# Altium project Power.PrjPcb
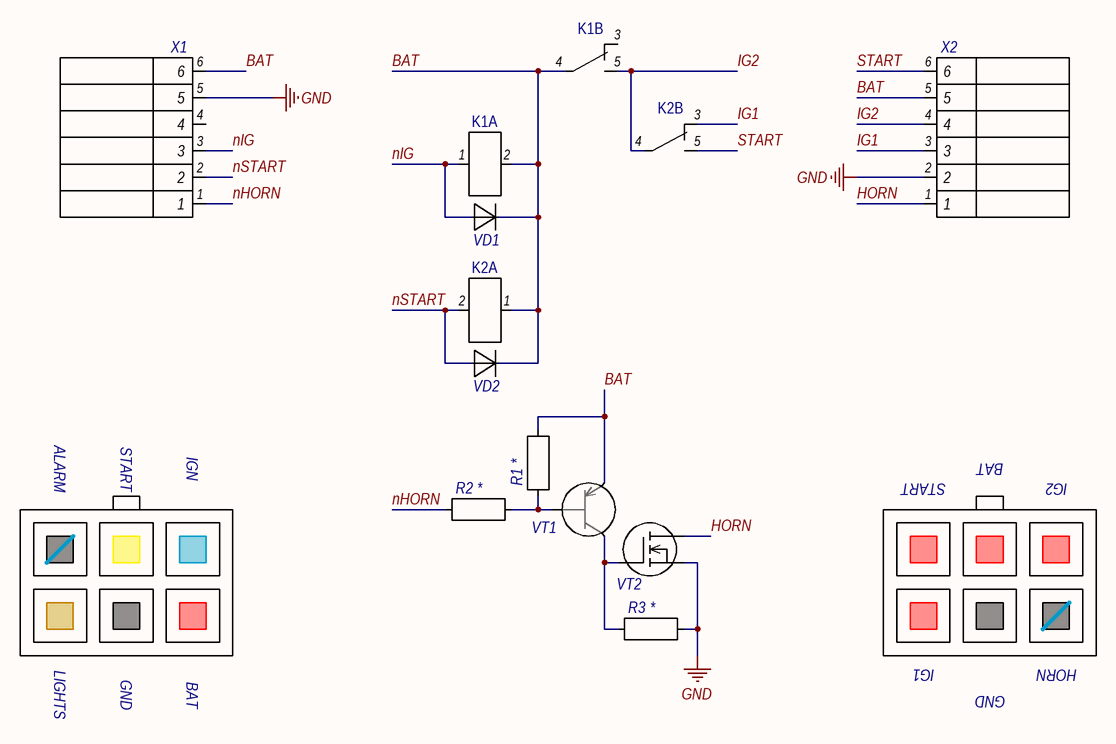
[diagram p0: Power.SchDoc]
1 sheet, 11 parts. Net scope: global (net labels, ports and power ports of the same name join across sheets).
Board file: Power.PcbDoc

## Sheet Power.SchDoc
size A4

### Parts
K1  Relay, SPDT  [NRP07-C12D]  (value not drawn)  (parts A,B of 2)
K2  Relay, SPDT  [NRP07-C12D]  (value not drawn)  (parts A,B of 2)
R1  Резистор  [CHIP_0805_R]  (value not drawn)
R2  Резистор  [CHIP_0805_R]  (value not drawn)
R3  Резистор  [CHIP_0805_R]  (value not drawn)
VD1  Diode, generic  [SMA]  (value not drawn)
VD2  Diode, generic  [SMA]  (value not drawn)
VT1  BJT, PNP  [SOT-23]  (value not drawn)
VT2  MOSFET, N-ch  [TO-220]  (value not drawn)
X1  MF 2x03 M(R)  [MF 2x03 V]  (value not drawn)
X2  MF 2x03 M(R)  [MF 2x03 R]  (value not drawn)

### Nets
GND: R3.2 VT2.3 X1.5 X2.2
BAT: K1.2 K1.4 K2.1 R1.2 VD1.K VD2.K VT1.3 X1.6 X2.5
HORN: VT2.2 X2.1
IG1: K2.3 X2.3
IG2: K1.5 K2.4 X2.4
nHORN: R2.1 X1.1
nIG: K1.1 VD1.A X1.3
nSTART: K2.2 VD2.A X1.2
START: K2.5 X2.6
NetR1_1: R1.1 R2.2 VT1.1
NetR3_1: R3.1 VT1.2 VT2.1

Not connected (* = marked no-connect by the designer): K1 3; X1 4

### Notes on the sheet
- ALARM
- START
- IGN
- BAT
- IG2
- LIGHTS
- GND
- IG1
- HORN

### Library data of the parts
K1 K2 = Relay, SPDT: Реле, SPDT; pin to pad: 3>4 4>3
X1 X2 = MF 2x03 M(R): MiniFit, 4.20mm 2x03; PartNumber: *; Mfg: *
R1-R3 = Резистор: PartNumber: *; Mfg: *; Value: *
VD1 VD2 = Diode, generic: PartNumber: *; Mfg: *
VT1 = BJT, PNP: PartNumber: *; Mfg: *
VT2 = MOSFET, N-ch: PartNumber: *; Mfg: *